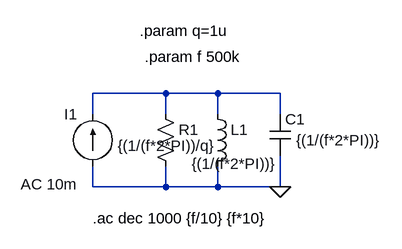
[diagram p0: schematic RLC en paralelo.asc]
RLC en paralelo.asc, the LTspice schematic file:
Version 4
SHEET 1 880 680
WIRE 192 112 80 112
WIRE 272 112 192 112
WIRE 368 112 272 112
WIRE 80 144 80 112
WIRE 192 144 192 112
WIRE 272 144 272 112
WIRE 368 144 368 112
WIRE 80 256 80 224
WIRE 192 256 192 224
WIRE 192 256 80 256
WIRE 272 256 272 224
WIRE 272 256 192 256
WIRE 368 256 368 208
WIRE 368 256 272 256
FLAG 368 256 0
SYMBOL current 80 224 R180
WINDOW 0 24 80 Left 2
WINDOW 3 24 0 Left 2
WINDOW 123 24 -28 Left 2
WINDOW 39 0 0 Left 0
SYMATTR InstName I1
SYMATTR Value ""
SYMATTR Value2 AC 10m
SYMBOL res 176 128 R0
WINDOW 3 -58 65 Left 2
SYMATTR InstName R1
SYMATTR Value {(1/(f*2*PI))/q}
SYMBOL ind 256 128 R0
WINDOW 3 -24 92 Left 2
SYMATTR InstName L1
SYMATTR Value {(1/(f*2*PI))}
SYMBOL cap 352 144 R0
WINDOW 3 41 40 Left 2
SYMATTR InstName C1
SYMATTR Value {(1/(f*2*PI))}
TEXT 160 56 Left 2 !.param f 500k
TEXT 80 304 Left 2 !.ac dec 1000 {f/10} {f*10}
TEXT 152 16 Left 2 !.param q=1u

The netlist it stands for:
* RLC en paralelo.asc
I1 0 N001 AC 10m
R1 N001 0 {(1/(f*2*PI))/q}
L1 N001 0 {(1/(f*2*PI))}
C1 N001 0 {(1/(f*2*PI))}
.param f 500k
.ac dec 1000 {f/10} {f*10}
.param q=1u
.backanno
.end